# Altium schematic sheet 7  - Microcontroller.SchDoc
size A3
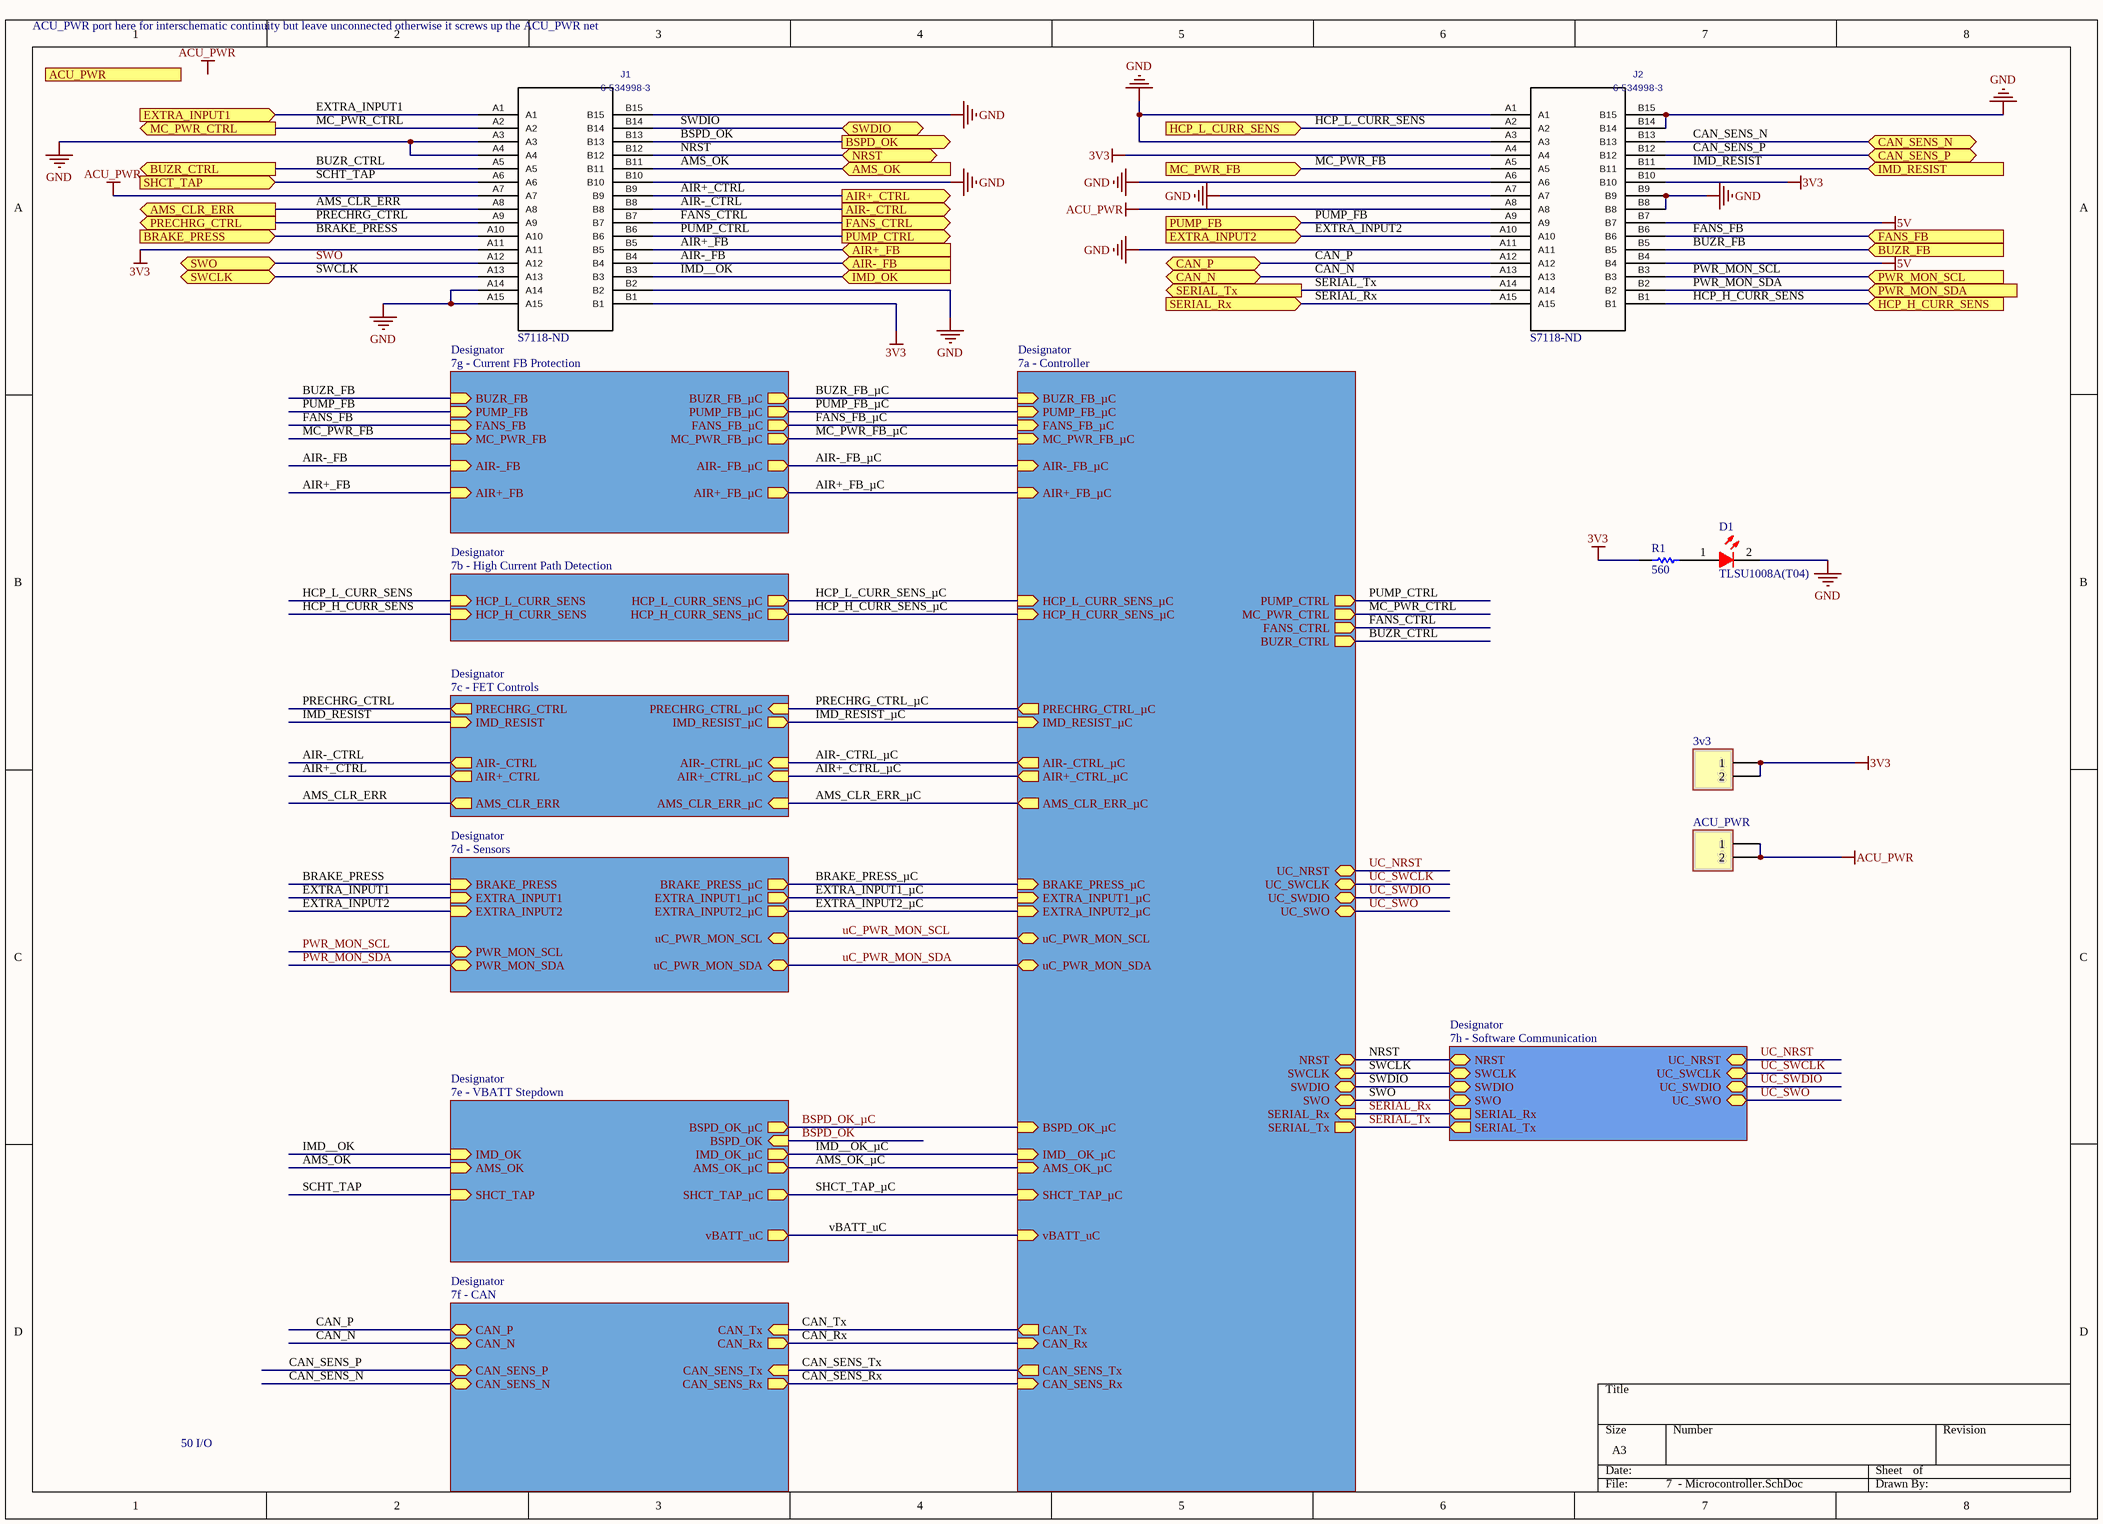
[diagram p0: 7  - Microcontroller.SchDoc]

## Parts
3v3  (no value)  [HDR1X2]
ACU_PWR  (no value)  [HDR1X2]
D1  TLSU1008A(T04)  [TOSH-0603LED_RED_V]
J1  6-534998-3  Supplier Part Number 1: S7118-ND  [6-534998-5_6-534998-5(Primary)]
J2  6-534998-3  Supplier Part Number 1: S7118-ND  [6-534998-5_6-534998-5(Primary)]
R1  560  [RESC0603(1608)_L]

## Sub-sheets
Designator = 7a - Controller: HCP_L_CURR_SENS_µC (in), HCP_H_CURR_SENS_µC (in), PRECHRG_CTRL_µC (out), IMD_RESIST_µC (in), AIR-_CTRL_µC (out), AIR+_CTRL_µC (out), AMS_CLR_ERR_µC (out), EXTRA_INPUT1_µC (in), EXTRA_INPUT2_µC (in), IMD__OK_µC (in), AMS_OK_µC (in), SHCT_TAP_µC (in), CAN_Tx (out), CAN_Rx (in), PUMP_CTRL (out), MC_PWR_CTRL (out), FANS_CTRL (out), BUZR_CTRL (out), NRST (bidir), SWCLK (bidir), SWDIO (bidir), BUZR_FB_µC (in), FANS_FB_µC (in), MC_PWR_FB_µC (in), PUMP_FB_µC (in), CAN_SENS_Tx (out), CAN_SENS_Rx (in), BRAKE_PRESS_µC (in), BSPD_OK_µC (in), SWO (bidir), UC_NRST (bidir), UC_SWCLK (bidir), UC_SWDIO (bidir), UC_SWO (bidir), uC_PWR_MON_SCL (bidir), AIR-_FB_µC (in), AIR+_FB_µC (in), uC_PWR_MON_SDA (bidir), SERIAL_Rx (in), SERIAL_Tx (out), vBATT_uC (in)
Designator = 7b - High Current Path Detection: HCP_L_CURR_SENS (in), HCP_H_CURR_SENS (in), HCP_L_CURR_SENS_µC (out), HCP_H_CURR_SENS_µC (out)
Designator = 7c - FET Controls: PRECHRG_CTRL (out), IMD_RESIST (in), AIR-_CTRL (out), AIR+_CTRL (out), AMS_CLR_ERR (out), PRECHRG_CTRL_µC (in), IMD_RESIST_µC (out), AIR-_CTRL_µC (in), AIR+_CTRL_µC (in), AMS_CLR_ERR_µC (in)
Designator = 7d - Sensors: EXTRA_INPUT1 (in), EXTRA_INPUT2 (in), EXTRA_INPUT1_µC (out), EXTRA_INPUT2_µC (out), BRAKE_PRESS (in), BRAKE_PRESS_µC (out), uC_PWR_MON_SCL (bidir), uC_PWR_MON_SDA (bidir), PWR_MON_SCL (bidir), PWR_MON_SDA (bidir)
Designator = 7e - VBATT Stepdown: IMD_OK (in), AMS_OK (in), SHCT_TAP (in), IMD_OK_µC (out), AMS_OK_µC (out), SHCT_TAP_µC (out), BSPD_OK (in), BSPD_OK_µC (out), vBATT_uC (out)
Designator = 7f - CAN: CAN_Tx (in), CAN_Rx (out), CAN_P (bidir), CAN_N (bidir), CAN_SENS_P (bidir), CAN_SENS_N (bidir), CAN_SENS_Tx (in), CAN_SENS_Rx (out)
Designator = 7g - Current FB Protection: BUZR_FB (in), PUMP_FB (in), FANS_FB (in), MC_PWR_FB (in), BUZR_FB_µC (out), PUMP_FB_µC (out), FANS_FB_µC (out), MC_PWR_FB_µC (out), AIR-_FB (in), AIR+_FB (in), AIR-_FB_µC (out), AIR+_FB_µC (out)
Designator = 7h - Software Communication: NRST (bidir), SWCLK (bidir), SWDIO (bidir), SWO (bidir), UC_NRST (bidir), UC_SWCLK (bidir), UC_SWDIO (bidir), UC_SWO (bidir), SERIAL_Rx (out), SERIAL_Tx (out)

## Ports
ACU_PWR (in), AIR+_CTRL (out), AIR+_FB (in), AIR-_CTRL (out), AIR-_FB (in), AMS_CLR_ERR (out), AMS_OK (in), BRAKE_PRESS (in), BSPD_OK (out), BUZR_CTRL (out), BUZR_FB (in), CAN_N (bidir), CAN_P (bidir), CAN_SENS_N (bidir), CAN_SENS_P (bidir), EXTRA_INPUT1 (in), EXTRA_INPUT2 (in), FANS_CTRL (out), FANS_FB (in), HCP_H_CURR_SENS (in), HCP_L_CURR_SENS (in), IMD_OK (in), IMD_RESIST (in), MC_PWR_CTRL (out), MC_PWR_FB (in), NRST (bidir), PRECHRG_CTRL (out), PUMP_CTRL (out), PUMP_FB (in), PWR_MON_SCL (in), PWR_MON_SDA (in), SERIAL_Rx (in), SERIAL_Tx (out), SHCT_TAP (in), SWCLK (bidir), SWDIO (bidir), SWO (bidir)

## Nets
3V3: 3v3.1 3v3.2 J1.A11 J1.B1 J2.A4 J2.B10 R1.1
5V: J2.B4 J2.B7
ACU_PWR: ACU_PWR.1 ACU_PWR.2 J1.A7 J2.A8
GND: D1.2(K) J1.A3 J1.A4 J1.A14 J1.A15 J1.B2 J1.B10 J1.B15 J2.A1 J2.A3 J2.A6 J2.A7 J2.A11 J2.B8 J2.B9 J2.B14 J2.B15
AIR+_CTRL: J1.B9 ; port AIR+_CTRL, sheet Designator/AIR+_CTRL
AIR+_CTRL_µC: sheet Designator/AIR+_CTRL_µC, sheet Designator/AIR+_CTRL_µC
AIR+_FB: J1.B5 ; port AIR+_FB, sheet Designator/AIR+_FB
AIR+_FB_µC: sheet Designator/AIR+_FB_µC, sheet Designator/AIR+_FB_µC
AIR-_CTRL: J1.B8 ; port AIR-_CTRL, sheet Designator/AIR-_CTRL
AIR-_CTRL_µC: sheet Designator/AIR-_CTRL_µC, sheet Designator/AIR-_CTRL_µC
AIR-_FB: J1.B4 ; port AIR-_FB, sheet Designator/AIR-_FB
AIR-_FB_µC: sheet Designator/AIR-_FB_µC, sheet Designator/AIR-_FB_µC
AMS_CLR_ERR: J1.A8 ; port AMS_CLR_ERR, sheet Designator/AMS_CLR_ERR
AMS_CLR_ERR_µC: sheet Designator/AMS_CLR_ERR_µC, sheet Designator/AMS_CLR_ERR_µC
AMS_OK: J1.B11 ; port AMS_OK, sheet Designator/AMS_OK
AMS_OK_µC: sheet Designator/AMS_OK_µC, sheet Designator/AMS_OK_µC
BRAKE_PRESS: J1.A10 ; port BRAKE_PRESS, sheet Designator/BRAKE_PRESS
BRAKE_PRESS_µC: sheet Designator/BRAKE_PRESS_µC, sheet Designator/BRAKE_PRESS_µC
BSPD_OK: J1.B13 ; port BSPD_OK, sheet Designator/BSPD_OK
BSPD_OK_µC: sheet Designator/BSPD_OK_µC, sheet Designator/BSPD_OK_µC
BUZR_CTRL: J1.A5 ; port BUZR_CTRL, sheet Designator/BUZR_CTRL
BUZR_FB: J2.B5 ; port BUZR_FB, sheet Designator/BUZR_FB
BUZR_FB_µC: sheet Designator/BUZR_FB_µC, sheet Designator/BUZR_FB_µC
CAN_N: J2.A13 ; port CAN_N, sheet Designator/CAN_N
CAN_P: J2.A12 ; port CAN_P, sheet Designator/CAN_P
CAN_Rx: sheet Designator/CAN_Rx, sheet Designator/CAN_Rx
CAN_SENS_N: J2.B13 ; port CAN_SENS_N, sheet Designator/CAN_SENS_N
CAN_SENS_P: J2.B12 ; port CAN_SENS_P, sheet Designator/CAN_SENS_P
CAN_SENS_Rx: sheet Designator/CAN_SENS_Rx, sheet Designator/CAN_SENS_Rx
CAN_SENS_Tx: sheet Designator/CAN_SENS_Tx, sheet Designator/CAN_SENS_Tx
CAN_Tx: sheet Designator/CAN_Tx, sheet Designator/CAN_Tx
EXTRA_INPUT1: J1.A1 ; port EXTRA_INPUT1, sheet Designator/EXTRA_INPUT1
EXTRA_INPUT1_µC: sheet Designator/EXTRA_INPUT1_µC, sheet Designator/EXTRA_INPUT1_µC
EXTRA_INPUT2: J2.A10 ; port EXTRA_INPUT2, sheet Designator/EXTRA_INPUT2
EXTRA_INPUT2_µC: sheet Designator/EXTRA_INPUT2_µC, sheet Designator/EXTRA_INPUT2_µC
FANS_CTRL: J1.B7 ; port FANS_CTRL, sheet Designator/FANS_CTRL
FANS_FB: J2.B6 ; port FANS_FB, sheet Designator/FANS_FB
FANS_FB_µC: sheet Designator/FANS_FB_µC, sheet Designator/FANS_FB_µC
HCP_H_CURR_SENS: J2.B1 ; port HCP_H_CURR_SENS, sheet Designator/HCP_H_CURR_SENS
HCP_H_CURR_SENS_µC: sheet Designator/HCP_H_CURR_SENS_µC, sheet Designator/HCP_H_CURR_SENS_µC
HCP_L_CURR_SENS: J2.A2 ; port HCP_L_CURR_SENS, sheet Designator/HCP_L_CURR_SENS
HCP_L_CURR_SENS_µC: sheet Designator/HCP_L_CURR_SENS_µC, sheet Designator/HCP_L_CURR_SENS_µC
IMD__OK: J1.B3 ; port IMD_OK, sheet Designator/IMD_OK
IMD__OK_µC: sheet Designator/IMD__OK_µC, sheet Designator/IMD_OK_µC
IMD_RESIST: J2.B11 ; port IMD_RESIST, sheet Designator/IMD_RESIST
IMD_RESIST_µC: sheet Designator/IMD_RESIST_µC, sheet Designator/IMD_RESIST_µC
MC_PWR_CTRL: J1.A2 ; port MC_PWR_CTRL, sheet Designator/MC_PWR_CTRL
MC_PWR_FB: J2.A5 ; port MC_PWR_FB, sheet Designator/MC_PWR_FB
MC_PWR_FB_µC: sheet Designator/MC_PWR_FB_µC, sheet Designator/MC_PWR_FB_µC
NRST: J1.B12 ; port NRST, sheet Designator/NRST, sheet Designator/NRST
PRECHRG_CTRL: J1.A9 ; port PRECHRG_CTRL, sheet Designator/PRECHRG_CTRL
PRECHRG_CTRL_µC: sheet Designator/PRECHRG_CTRL_µC, sheet Designator/PRECHRG_CTRL_µC
PUMP_CTRL: J1.B6 ; port PUMP_CTRL, sheet Designator/PUMP_CTRL
PUMP_FB: J2.A9 ; port PUMP_FB, sheet Designator/PUMP_FB
PUMP_FB_µC: sheet Designator/PUMP_FB_µC, sheet Designator/PUMP_FB_µC
PWR_MON_SCL: J2.B3 ; port PWR_MON_SCL, sheet Designator/PWR_MON_SCL
PWR_MON_SDA: J2.B2 ; port PWR_MON_SDA, sheet Designator/PWR_MON_SDA
SCHT_TAP: J1.A6 ; port SHCT_TAP, sheet Designator/SHCT_TAP
SERIAL_Rx: J2.A15 ; port SERIAL_Rx, sheet Designator/SERIAL_Rx, sheet Designator/SERIAL_Rx
SERIAL_Tx: J2.A14 ; port SERIAL_Tx, sheet Designator/SERIAL_Tx, sheet Designator/SERIAL_Tx
SHCT_TAP_µC: sheet Designator/SHCT_TAP_µC, sheet Designator/SHCT_TAP_µC
SWCLK: J1.A13 ; port SWCLK, sheet Designator/SWCLK, sheet Designator/SWCLK
SWDIO: J1.B14 ; port SWDIO, sheet Designator/SWDIO, sheet Designator/SWDIO
SWO: J1.A12 ; port SWO, sheet Designator/SWO, sheet Designator/SWO
UC_NRST: sheet Designator/UC_NRST, sheet Designator/UC_NRST
uC_PWR_MON_SCL: sheet Designator/uC_PWR_MON_SCL, sheet Designator/uC_PWR_MON_SCL
uC_PWR_MON_SDA: sheet Designator/uC_PWR_MON_SDA, sheet Designator/uC_PWR_MON_SDA
UC_SWCLK: sheet Designator/UC_SWCLK, sheet Designator/UC_SWCLK
UC_SWDIO: sheet Designator/UC_SWDIO, sheet Designator/UC_SWDIO
UC_SWO: sheet Designator/UC_SWO, sheet Designator/UC_SWO
vBATT_uC: sheet Designator/vBATT_uC, sheet Designator/vBATT_uC
NetD1_1: D1.1(A) R1.2

## Notes on the sheet
- ACU_PWR port here for interschematic continuity but leave unconnected otherwise it screws up the ACU_PWR net
- 50 I/O
- Labels drawn without touching a wire or pin: ACU_PWR

## Library data of the parts
3v3 ACU_PWR = Header 2: Header, 2-Pin; LatestRevisionDate: 17-Jul-2002; LatestRevisionNote: Re-released for DXP Platform.; Publisher: Altium Limited
D1 = CMP-0444-00001-1: LED, Red 0603 (1608) 63mCd; Manufacturer: Toshiba; Forward Current: 25 mA; Power Dissipation: 60 mW; Packing Type: Reel; Reverse Voltage: 4 V; Mounting Technology: Surface Mount; PackageDescription: 2-Pin SMT LED, 1.6 x 0.8 mm Pitch; ComponentLink1URL: http://www.toshiba-components.com/; ComponentLink1Description: Manufacturer URL; PackageReference: 0603LED_RED; PartNumber: TLSU1008A(T04); ComponentLink2URL: http://www.semicon.toshiba.co.jp/info/docget.jsp?type=datasheet&lang=en&pid=TLSU1008A(T04); ComponentLink2Description: Datasheet; DatasheetVersion: Aug-08; Storage Temperature: -40 to 100 degC
J1 J2 = 6-534998-3: C: Copyright (C) 2015 Accelerated Designs. All rights reserved; Vendor: TE Connectivity; Built_By: EMA_UL_Team; Value: 6-534998-3; Manufacturer_Part_Number: 6-534998-3; Supplier 1: Digi-Key
R1 = CMP-1591-00001-1: 0603 (1608 Metric) Chip Resistor; Case-Metric: 1608; Case-EIA: 0603; PackageReference: RESC0603(1608)